# EAGLE design ardufocus (EAGLE 9.3.0)
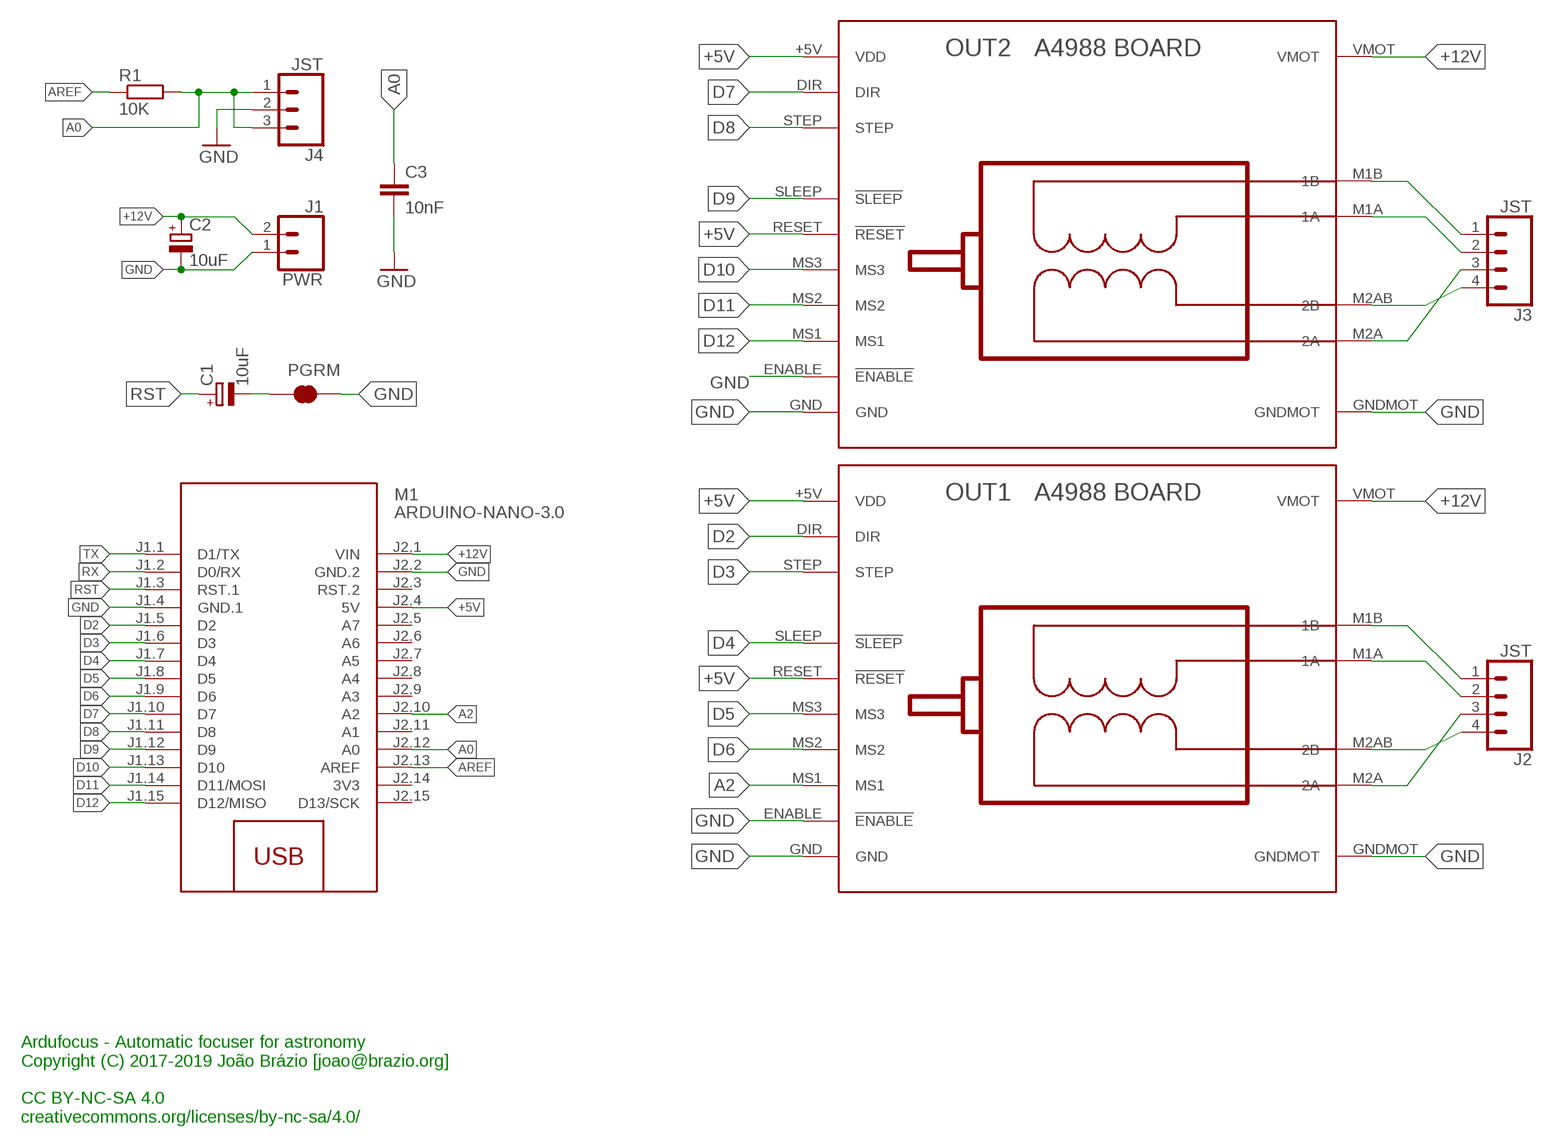
[diagram p0: schematic, sheet 1]

## Parts
C1  10uF  CPOL-EUE1.8-4  [E1,8-4]
C2  10uF  CPOL-EUE2,5-6E  [E2,5-6E]
C3  10nF  C-EUC3216  [C3216]
J1  PWR  CONN_025MM  [SCREWTERMINAL-5MM-2]
J2  JST  CONN_04JST-PTH-VERT  [JST-4-PTH-VERT]
J3  JST  CONN_04JST-PTH-VERT  [JST-4-PTH-VERT]
J4  JST  CONN_03JST-PTH-VERT  [JST-3-PTH-VERT]
M1  ARDUINO-NANO-3.0  [ARDUINO-NANO-3.0]
OUT1  BOARD_A4988  [BOARD_A4988]
OUT2  BOARD_A4988  [BOARD_A4988]
PGRM  JUMPER-SMT_2_NC_TRACE_SILK  [SMT-JUMPER_2_NC_TRACE_SILK]
R1  10K  R-EU_M1206  [M1206]

## Nets
+5V [pwr5]: M1.J2.4(5V) OUT1.+5V(VDD) OUT1.RESET(!RESET) OUT2.+5V(VDD) OUT2.RESET(!RESET)
+12V [pwr12]: C2.+ J1.2 M1.J2.1(VIN) OUT1.VMOT OUT2.VMOT
A0 [analog]: C3.1 J4.1 J4.3 M1.J2.12(A0) R1.2
A2: M1.J2.10(A2) OUT1.MS1
AREF [analog]: M1.J2.13(AREF) R1.1
D2: M1.J1.5(D2) OUT1.DIR
D3: M1.J1.6(D3) OUT1.STEP
D4: M1.J1.7(D4) OUT1.SLEEP(!SLEEP)
D5: M1.J1.8(D5) OUT1.MS3
D6: M1.J1.9(D6) OUT1.MS2
D7: M1.J1.10(D7) OUT2.DIR
D8: M1.J1.11(D8) OUT2.STEP
D9: M1.J1.12(D9) OUT2.SLEEP(!SLEEP)
D10: M1.J1.13(D10) OUT2.MS3
D11: M1.J1.14(D11/MOSI) OUT2.MS2
D12: M1.J1.15(D12/MISO) OUT2.MS1
GND: C2.- C3.2 J1.1 J4.2 M1.J1.4(GND.1) M1.J2.2(GND.2) OUT1.ENABLE(!ENABLE) OUT1.GND OUT1.GNDMOT OUT2.ENABLE(!ENABLE) OUT2.GND OUT2.GNDMOT PGRM.2
N$1 [motor]: J3.1 OUT2.M1B(1B)
N$2: C1.- PGRM.1
N$9 [motor]: J2.3 OUT1.M2A(2A)
N$10 [motor]: J3.2 OUT2.M1A(1A)
N$12 [motor]: J3.4 OUT2.M2AB(2B)
N$13 [motor]: J2.1 OUT1.M1B(1B)
N$14 [motor]: J2.2 OUT1.M1A(1A)
N$15 [motor]: J2.4 OUT1.M2AB(2B)
N$16 [motor]: J3.3 OUT2.M2A(2A)
RST: C1.+ M1.J1.3(RST.1)
RX: M1.J1.2(D0/RX)
TX: M1.J1.1(D1/TX)
Unconnected: M1.J2.3(RST.2) M1.J2.5(A7) M1.J2.6(A6) M1.J2.7(A5) M1.J2.8(A4) M1.J2.9(A3) M1.J2.11(A1) M1.J2.15(D13/SCK)

## Notes on the sheet
- Ardufocus - Automatic focuser for astronomy
  Copyright (C) 2017-2019 João Brázio [joao@brazio.org]
  
  CC BY-NC-SA 4.0
  creativecommons.org/licenses/by-nc-sa/4.0/

## Power pins joined to a net without a drawn wire
3V3: M1.J2.14(3V3)

## Library data of the parts
C1 C2 = rcl:CPOL-EU: POLARIZED CAPACITOR, European symbol; SPICEPREFIX: C
C3 = rcl:C-EU: CAPACITOR, European symbol; SPICEPREFIX: C
J1 = SparkFun-Connectors:CONN_02: Multi connection point. Often used as Generic Header-pin footprint for 0.1 inch spaced/style header connections On any of the 0.1 inch spaced packages, you can populate with these: Break Away Headers - Straight <https://www.sparkfun.com/products/116> (PRT-00116) Break Away Male Headers - Right Angle <https://www.sparkfun.com/products/553> (PRT-00553) Female Headers <https://www.sparkfun.com/products/115> (PRT-00115) Break Away Headers - Machine Pin <https://www.sparkfun.com/products/117> (PRT-00117) Break Away Female Headers - Swiss Machine Pin <https://www.sparkfun.com/products/743> (PRT-00743) For SCREWTERMINALS and SPRING TERMINALS visit here: Screw Terimnals on SparkFun.com <https://www.sparkfun.com/search/results?term=Screw+Terminals> (5mm/3.5mm/2.54mm spacing) This device is also useful as a general connection point to wire up your design to another part of your project. Our various solder wires solder well into these plated through hole pads. Hook-Up Wire - Assortment (Stranded, 22 AWG) <https://www.sparkfun.com/products/11375> (PRT-11375) Hook-Up Wire - Assortment (Solid Core, 22 AWG) <https://www.sparkfun.com/products/11367> (PRT-11367) View the entire wire category on our website here <https://www.sparkfun.com/categories/141> Special notes: Molex polarized connector foot print use with: PRT-08233 with associated crimp pins and housings. 2.54_SCREWTERM for use with PRT-10571. 3.5mm Screw Terminal footprints for PRT-08084 5mm Screw Terminal footprints for use with PRT-08432; SF_SKU: PRT-08432
J2 J3 = SparkFun-Connectors:CONN_04: Multi connection point. Often used as Generic Header-pin footprint for 0.1 inch spaced/style header connections On any of the 0.1 inch spaced packages, you can populate with these: Break Away Headers - Straight <https://www.sparkfun.com/products/116> (PRT-00116) Break Away Male Headers - Right Angle <https://www.sparkfun.com/products/553> (PRT-00553) Female Headers <https://www.sparkfun.com/products/115> (PRT-00115) Break Away Headers - Machine Pin <https://www.sparkfun.com/products/117> (PRT-00117) Break Away Female Headers - Swiss Machine Pin <https://www.sparkfun.com/products/743> (PRT-00743) For SCREWTERMINALS and SPRING TERMINALS visit here: Screw Terimnals on SparkFun.com <https://www.sparkfun.com/search/results?term=Screw+Terminals> (5mm/3.5mm/2.54mm spacing) This device is also useful as a general connection point to wire up your design to another part of your project. Our various solder wires solder well into these plated through hole pads. Hook-Up Wire - Assortment (Stranded, 22 AWG) <https://www.sparkfun.com/products/11375> (PRT-11375) Hook-Up Wire - Assortment (Solid Core, 22 AWG) <https://www.sparkfun.com/products/11367> (PRT-11367) View the entire wire category on our website here <https://www.sparkfun.com/categories/141> Special notes: Molex polarized connector foot print use with SKU : PRT-08231 with associated crimp pins and housings. 1MM SMD Version SKU: PRT-10208; PROD_ID: CONN-13251
J4 = SparkFun-Connectors:CONN_03: Multi connection point. Often used as Generic Header-pin footprint for 0.1 inch spaced/style header connections On any of the 0.1 inch spaced packages, you can populate with these: Break Away Headers - Straight <https://www.sparkfun.com/products/116> (PRT-00116) Break Away Male Headers - Right Angle <https://www.sparkfun.com/products/553> (PRT-00553) Female Headers <https://www.sparkfun.com/products/115> (PRT-00115) Break Away Headers - Machine Pin <https://www.sparkfun.com/products/117> (PRT-00117) Break Away Female Headers - Swiss Machine Pin <https://www.sparkfun.com/products/743> (PRT-00743) Stackable Header - 3 Pin (Female, 0.1") <https://www.sparkfun.com/products/13875> (PRT-13875) For SCREWTERMINALS and SPRING TERMINALS visit here: Screw Terimnals on SparkFun.com <https://www.sparkfun.com/search/results?term=Screw+Terminals> (5mm/3.5mm/2.54mm spacing) This device is also useful as a general connection point to wire up your design to another part of your project. Our various solder wires solder well into these plated through hole pads. Hook-Up Wire - Assortment (Stranded, 22 AWG) <https://www.sparkfun.com/products/11375> (PRT-11375) Hook-Up Wire - Assortment (Solid Core, 22 AWG) <https://www.sparkfun.com/products/11367> (PRT-11367) View the entire wire category on our website here <https://www.sparkfun.com/categories/141> Special notes: Molex polarized connector foot print use with SKU : PRT-08232 with associated crimp pins and housings.; PROD_ID: CONN-13230
M1 = diy-modules:ARDUINO-NANO-3.0: Arduino Nano 3.0 and compatible devices More details available here: https://www.arduino.cc/en/Main/ArduinoBoardNano Click here to find device on ebay.com <http://www.ebay.com/sch/arduino+nano>
OUT1 OUT2 = Clean-Kong:BOARD_A4988
PGRM = SparkFun-Jumpers:JUMPER-SMT_2_NC_TRACE: Normally closed trace jumper This jumper has a trace between two pads so it's normally closed (NC). Use a razor knife to open the connection. For best results follow the IPC guidelines for cutting traces: Cutout at least 0.063 mm (0.005 in). Remove all loose material to clean up the cut area. Seal the cut with an approved epoxy. Reapply solder to reclose the connection.
R1 = rcl:R-EU_: RESISTOR, European symbol; SPICEPREFIX: R

## Net classes
0 default: width 0.254 mm, clearance 0.254 mm
1 pwr5: width 1.143 mm, clearance 0.381 mm
2 pwr12: width 2.286 mm, clearance 0.508 mm
3 motor: width 1.143 mm, clearance 0.381 mm
4 analog: width 0.635 mm, clearance 0.381 mm

## Board
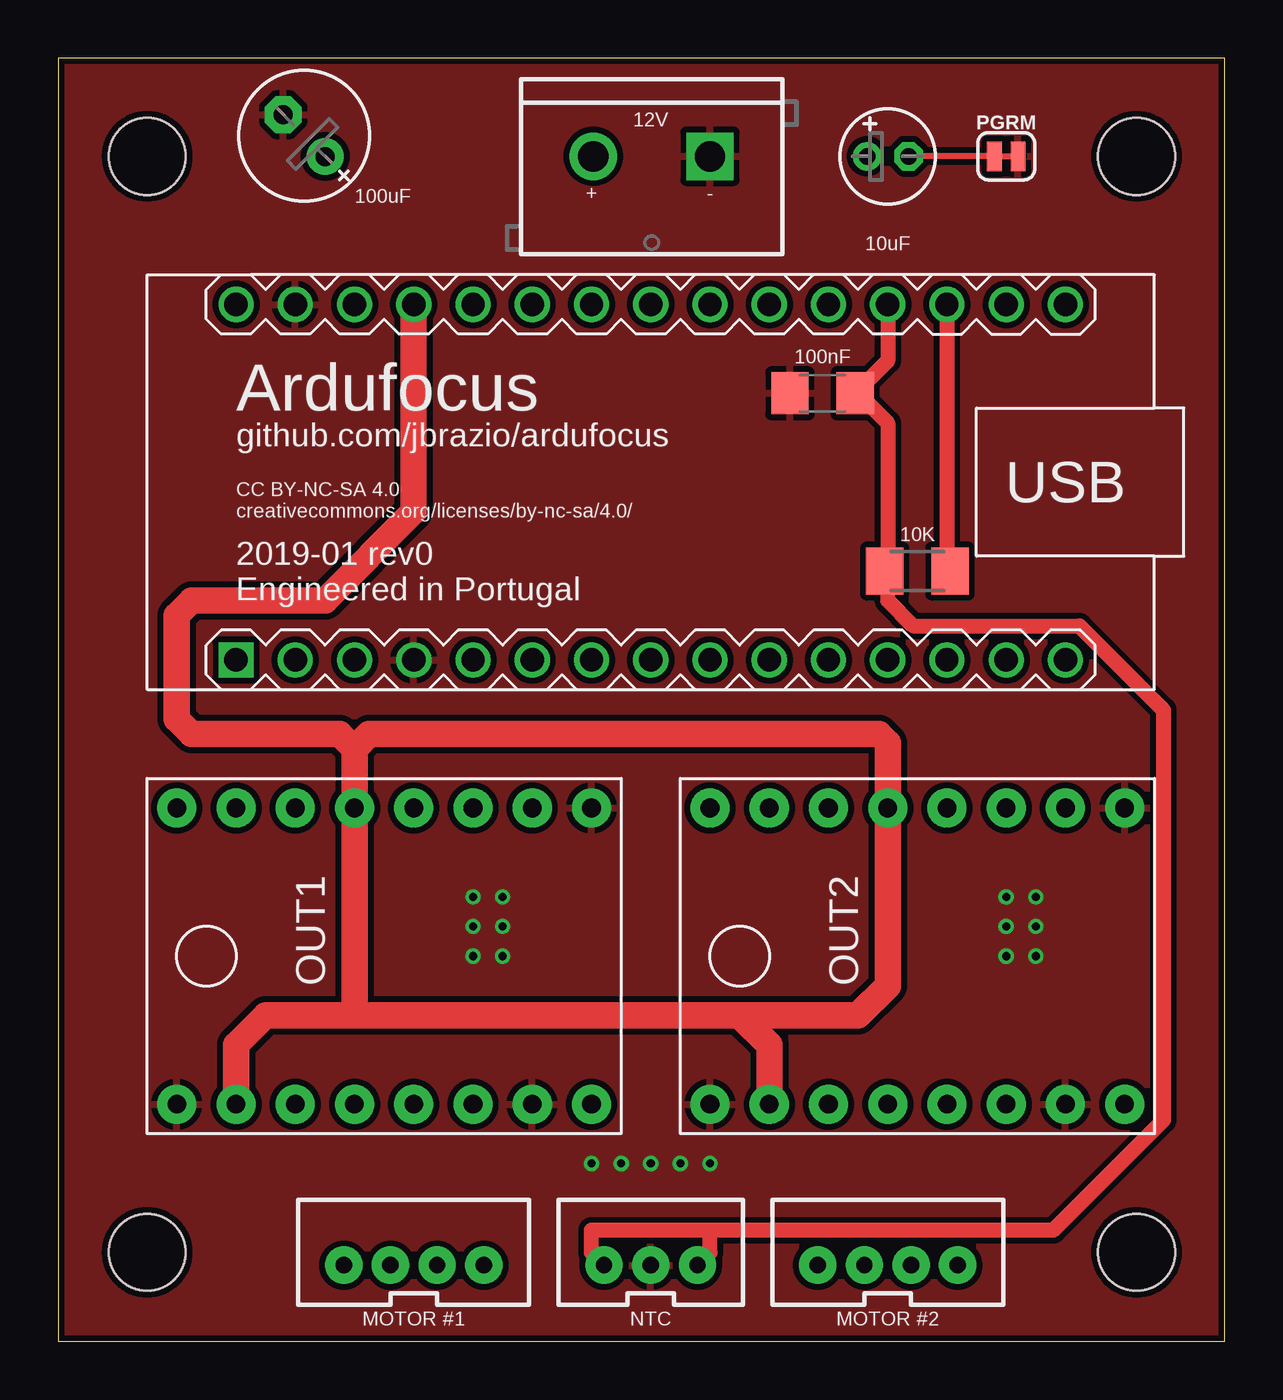
[diagram p1: board, top side]
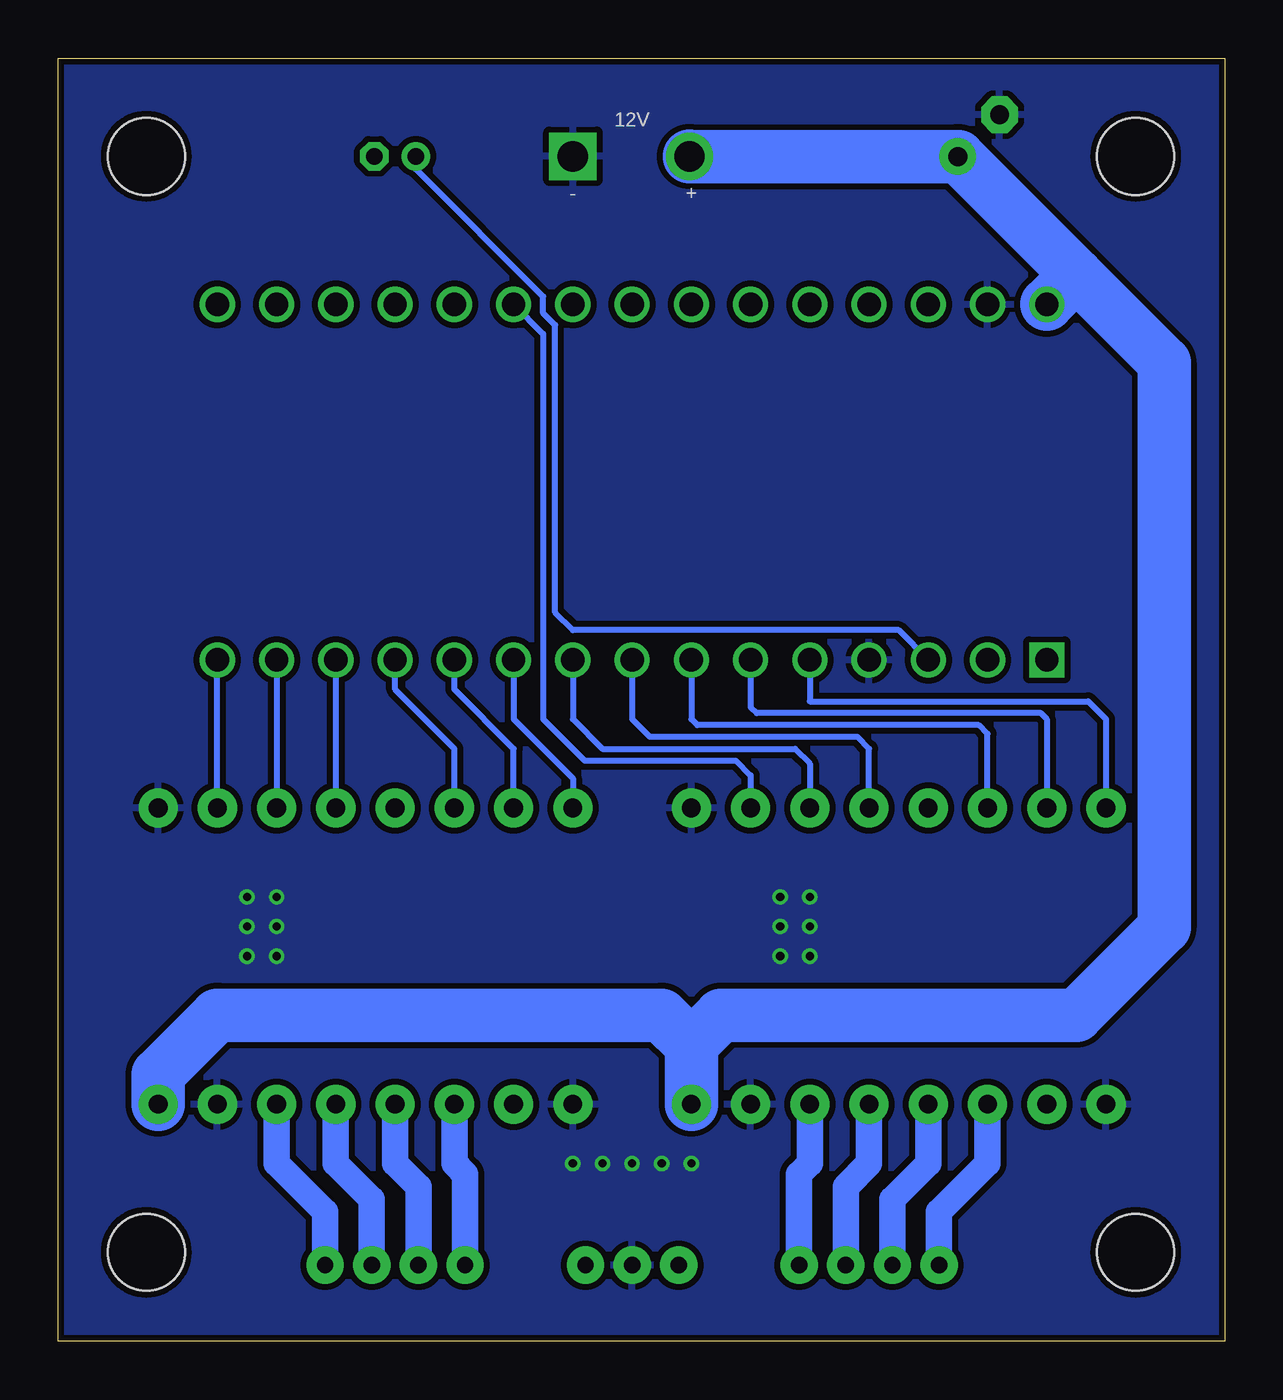
[diagram p2: board, bottom side, seen from below]

Size 50 x 55 mm. Coordinates in mm from the lower left corner, seen from the top.
Outline: 0,0 50,0 50,55 0,55 0,0
Copper layers (1*16): Top 0.035mm / dielectric 1.5mm / Bottom 0.035mm
Design rules "SeeedStudio_2layer_DRU_no_angle_20140221": minimum track width 6mil, minimum drill 12mil, track to track 6mil, track to pad 6mil, pad to pad 6mil, via to via 6mil, smd to smd 0mil, copper to edge 10mil, drill to drill 10mil, minimum pad ring 10mil, minimum via ring 6mil, stop-mask expansion 2mil, vias tented up to drill 100mil, thermal gap 10mil

### Footprints (pad centres in the part's own frame; a part is rotated, then mirrored left to right if it is on the bottom)
E1,8-4 = drill 0.711 pad 1.168: + -0.889,0 | drill 0.711 pad 1.168 octagon: - 0.889,0
E2,5-6E = drill 0.813 pad 1.575: + -1.27,0 | drill 0.813 pad 1.575 octagon: - 1.27,0
C3216 = smd 1.6 x 1.8: 1 -1.4,0; 2 1.4,0
SCREWTERMINAL-5MM-2 = drill 1.3 pad 2.032 square: 1 0,0 | drill 1.3 pad 2.032: 2 5,0
JST-4-PTH-VERT = drill 0.7 pad 1.6: 1 -3,-0.55; 2 -1,-0.55; 3 1,-0.55; 4 3,-0.55
JST-3-PTH-VERT = drill 0.7 pad 1.6: 1 -2,-0.55; 2 0,-0.55; 3 2,-0.55
ARDUINO-NANO-3.0 = drill 1 square: J1.1 17.78,7.62 | drill 1: J1.2 15.24,7.62; J1.3 12.7,7.62; J1.4 10.16,7.62; J1.5 7.62,7.62; J1.6 5.08,7.62; J1.7 2.54,7.62; J1.8 0,7.62; J1.9 -2.54,7.62; J1.10 -5.08,7.62; J1.11 -7.62,7.62; J1.12 -10.16,7.62; J1.13 -12.7,7.62; J1.14 -15.24,7.62; J1.15 -17.78,7.62; J2.1 17.78,-7.62; J2.2 15.24,-7.62; J2.3 12.7,-7.62; J2.4 10.16,-7.62; J2.5 7.62,-7.62; J2.6 5.08,-7.62; J2.7 2.54,-7.62; J2.8 0,-7.62; J2.9 -2.54,-7.62; J2.10 -5.08,-7.62; J2.11 -7.62,-7.62; J2.12 -10.16,-7.62; J2.13 -12.7,-7.62; J2.14 -15.24,-7.62; J2.15 -17.78,-7.62
BOARD_A4988 = drill 0.8 pad 1.676: +5V 1.27,16.51; DIR 13.97,19.05; ENABLE 13.97,1.27; GND 1.27,19.05; GNDMOT 1.27,3.81; M1A 1.27,11.43; M1B 1.27,13.97; M2A 1.27,8.89; M2AB 1.27,6.35; MS1 13.97,3.81; MS2 13.97,6.35; MS3 13.97,8.89; RESET 13.97,11.43; SLEEP 13.97,13.97; STEP 13.97,16.51; VMOT 1.27,1.27
SMT-JUMPER_2_NC_TRACE_SILK = smd 0.635 x 1.27: 1 -0.508,0; 2 0.508,0
M1206 = smd 1.6 x 2: 1 -1.4,0; 2 1.4,0
STAND-OFF = hole 3.302: 0,0

### Placement (x,y rotation side)
C1  35.56,50.8 0 top
C2  10.54,51.69 135 top
C3  32.77,40.64 180 top
J1  27.94,50.8 180 top
J2  15.24,3.81 0 top
J3  35.56,3.81 0 top
J4  25.4,3.81 0 top
M1  25.4,36.83 180 top
OUT1  24.13,8.89 90 top
OUT2  46.99,8.89 90 top
PGRM  40.64,50.8 0 top
R1  36.83,33.02 180 top
U$1  [STAND-OFF]  3.81,50.8 0 top
U$2  [STAND-OFF]  3.81,3.81 0 top
U$3  [STAND-OFF]  46.23,3.81 0 top
U$4  [STAND-OFF]  46.23,50.8 0 top

### Tracks (layer width: path | path; a pad name or v marks a point on that pad's centre or on a via)
+5V
  Top 1.143: 29.21,13.97 30.48,12.7 OUT2.+5V | OUT1.+5V 7.62,12.7 8.89,13.97 12.7,13.97 | 12.7,13.97 29.21,13.97 | 12.7,13.97 OUT1.RESET 12.7,25.4 | 29.21,13.97 34.29,13.97 35.56,15.24 OUT2.RESET 35.56,25.65 35.18,26.04 13.34,26.04 12.7,25.4 | 12.7,25.4 12.06,26.04 5.71,26.04 5.08,26.67 5.08,31.11 5.71,31.75 11.43,31.75 15.24,35.56 M1.J2.4
+12V
  Bottom 2.286: OUT1.VMOT 22.86,12.7 | 22.86,12.7 24.13,13.97 43.18,13.97 45.72,11.43 OUT2.VMOT | 22.86,12.7 21.59,13.97 6.35,13.97 2.59,17.73 2.59,41.96 6.35,45.72 | M1.J2.1 6.35,45.72 | 6.35,45.72 11.42,50.79 C2.+ J1.2
A0
  Top 0.635: M1.J2.12 35.56,42.03 C3.1 34.29,40.64 35.56,39.37 35.56,33.02 | 27.94,4.76 42.67,4.76 47.38,9.47 47.38,27.06 43.78,30.66 36.65,30.66 35.56,31.75 35.56,33.02 | J4.3 27.94,3.8 27.94,4.76 | 27.94,4.76 22.86,4.76 22.86,3.8 J4.1 | 35.56,33.02 R1.2
A2
  Bottom 0.254: OUT1.MS1 20.32,24.26 20.95,24.89 27.43,24.89 29.21,26.67 29.21,43.18 M1.J2.10
AREF
  Top 0.635: M1.J2.13 38.1,33.15 R1.1
D2
  Bottom 0.254: M1.J1.5 17.78,27.43 5.84,27.43 5.08,26.67 OUT1.DIR
D3
  Bottom 0.254: OUT1.STEP 7.62,26.67 7.87,26.92 20.07,26.92 20.32,27.18 M1.J1.6
D4
  Bottom 0.254: OUT1.SLEEP 10.16,26.04 10.54,26.42 22.61,26.42 22.86,26.67 M1.J1.7
D5
  Bottom 0.254: OUT1.MS3 15.24,25.4 15.75,25.91 24.64,25.91 25.4,26.67 M1.J1.8
D6
  Bottom 0.254: M1.J1.9 27.94,26.67 26.67,25.4 18.41,25.4 17.78,24.77 OUT1.MS2
D7
  Bottom 0.254: OUT2.DIR 27.94,24.13 30.48,26.67 M1.J1.10
D8
  Bottom 0.254: OUT2.STEP 30.48,25.4 33.02,27.94 M1.J1.11
D9
  Bottom 0.254: OUT2.SLEEP 33.02,25.4 35.56,27.94 M1.J1.12
D10
  Bottom 0.254: M1.J1.13 OUT2.MS3
D11
  Bottom 0.254: M1.J1.14 OUT2.MS2
D12
  Bottom 0.254: OUT2.MS1 M1.J1.15
GND  (via drill 0.35)
  other vias: 22.86,7.62 24.13,7.62 25.4,7.62 26.67,7.62 17.78,19.05 19.05,19.05 17.78,17.78 19.05,17.78 19.05,16.51 17.78,16.51 41.91,16.51 40.64,16.51 40.64,17.78 40.64,19.05 41.91,19.05 41.91,17.78 27.94,7.62
  pour Top: -1.27,55.88 50.8,55.88 50.8,-1.27 -1.27,-1.27
  pour Bottom: -2.54,57.15 52.07,57.15 52.07,-2.54 -2.54,-2.54
N$1
  Bottom 1.143: J3.1 32.56,7.16 33.02,7.62 OUT2.M1B
N$2
  Top 0.254: PGRM.1 C1.-
N$9
  Bottom 1.143: J2.3 16.24,6.62 15.24,7.62 OUT1.M2A
N$10
  Bottom 1.143: J3.2 34.56,6.62 35.56,7.62 OUT2.M1A
N$12
  Bottom 1.143: J3.4 38.56,5.54 40.64,7.62 OUT2.M2AB
N$13
  Bottom 1.143: J2.1 12.24,5.54 10.16,7.62 OUT1.M1B
N$14
  Bottom 1.143: J2.2 14.24,6.08 12.7,7.62 OUT1.M1A
N$15
  Bottom 1.143: J2.4 18.24,7.16 17.78,7.62 OUT1.M2AB
N$16
  Bottom 1.143: J3.3 36.56,6.08 38.1,7.62 OUT2.M2A
RST
  Bottom 0.254: M1.J1.3 13.97,30.48 27.94,30.48 28.7,31.24 28.7,43.56 29.21,44.07 29.21,44.78 34.67,50.25 C1.+

### Text on the board
tPlace: Ardufocus | github.com/jbrazio/ardufocus | CC BY-NC-SA 4.0 / creativecommons.org/licenses/by-nc-sa/4.0/ | 2019-01 rev0 / Engineered in Portugal
tNames: 12V | + | - | 100uF | 10uF | 100nF | 10K | MOTOR #1 | NTC | MOTOR #2
bNames: 12V | + | -